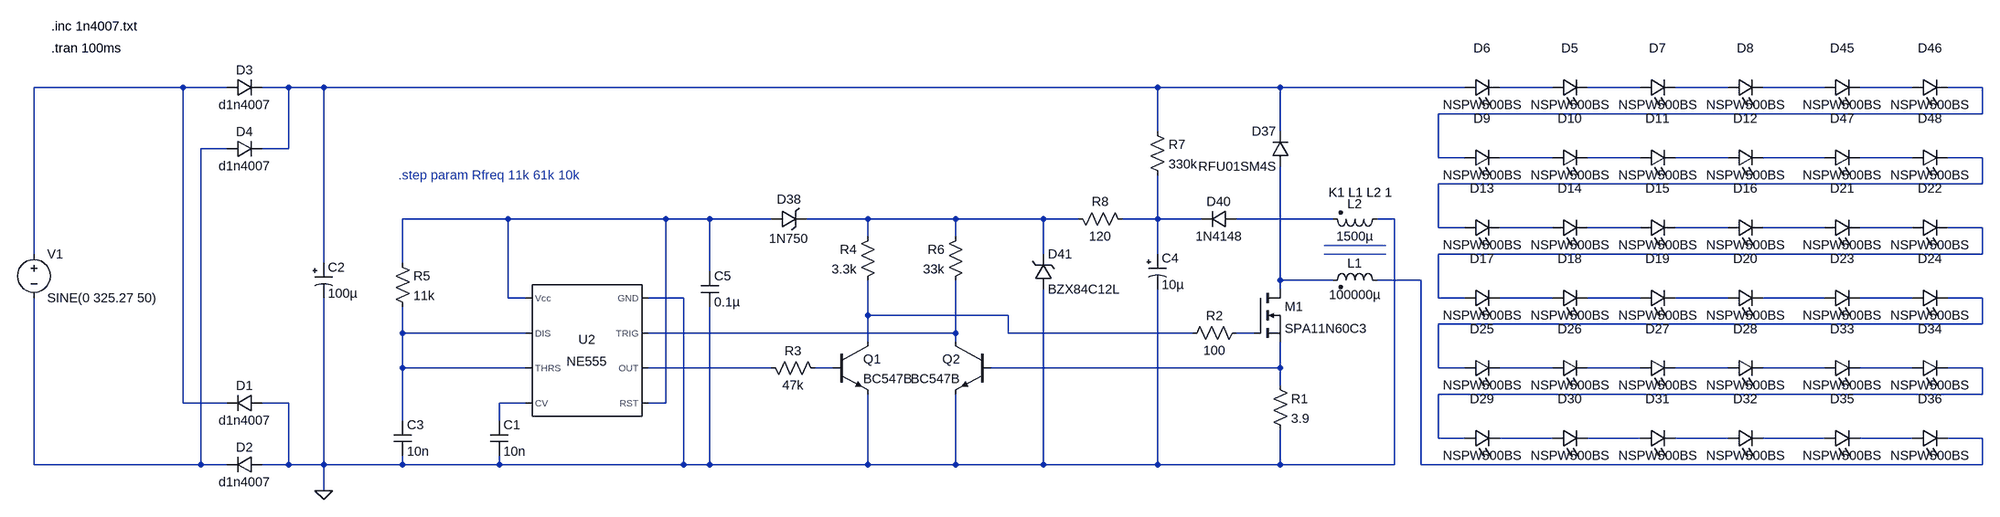
[diagram p0: schematic AC LED Driver 5.asc]
AC LED Driver 5.asc, the LTspice schematic file:
Version 4
SHEET 1 4020 1492
WIRE 736 -16 464 -16
WIRE 816 -16 736 -16
WIRE 928 -16 880 -16
WIRE 992 -16 928 -16
WIRE 2512 -16 992 -16
WIRE 2736 -16 2512 -16
WIRE 3072 -16 2736 -16
WIRE 3232 -16 3136 -16
WIRE 3392 -16 3296 -16
WIRE 3552 -16 3456 -16
WIRE 3728 -16 3616 -16
WIRE 3888 -16 3792 -16
WIRE 4016 -16 3952 -16
WIRE 4016 32 4016 -16
WIRE 4016 32 3024 32
WIRE 2512 64 2512 -16
WIRE 2736 64 2736 -16
WIRE 816 96 768 96
WIRE 928 96 928 -16
WIRE 928 96 880 96
WIRE 3024 112 3024 32
WIRE 3072 112 3024 112
WIRE 3232 112 3136 112
WIRE 3392 112 3296 112
WIRE 3552 112 3456 112
WIRE 3728 112 3616 112
WIRE 3888 112 3792 112
WIRE 4016 112 3952 112
WIRE 4016 160 4016 112
WIRE 4016 160 3024 160
WIRE 1328 224 1136 224
WIRE 1616 224 1328 224
WIRE 1696 224 1616 224
WIRE 1808 224 1696 224
WIRE 1984 224 1872 224
WIRE 2144 224 1984 224
WIRE 2304 224 2144 224
WIRE 2368 224 2304 224
WIRE 2512 224 2512 144
WIRE 2512 224 2448 224
WIRE 2592 224 2512 224
WIRE 2832 224 2656 224
WIRE 2944 224 2912 224
WIRE 3024 240 3024 160
WIRE 3072 240 3024 240
WIRE 3232 240 3136 240
WIRE 3392 240 3296 240
WIRE 3552 240 3456 240
WIRE 3728 240 3616 240
WIRE 3888 240 3792 240
WIRE 4016 240 3952 240
WIRE 1984 256 1984 224
WIRE 2144 256 2144 224
WIRE 464 288 464 -16
WIRE 2304 288 2304 224
WIRE 2512 288 2512 224
WIRE 4016 288 4016 240
WIRE 4016 288 3024 288
WIRE 992 304 992 -16
WIRE 1136 304 1136 224
WIRE 1696 320 1696 224
WIRE 2736 336 2736 128
WIRE 2832 336 2736 336
WIRE 2992 336 2912 336
WIRE 2736 352 2736 336
WIRE 1328 368 1328 224
WIRE 1360 368 1328 368
WIRE 1648 368 1584 368
WIRE 3024 368 3024 288
WIRE 3072 368 3024 368
WIRE 3232 368 3136 368
WIRE 3392 368 3296 368
WIRE 3552 368 3456 368
WIRE 3728 368 3616 368
WIRE 3888 368 3792 368
WIRE 4016 368 3952 368
WIRE 1984 400 1984 336
WIRE 2240 400 1984 400
WIRE 4016 416 4016 368
WIRE 4016 416 3024 416
WIRE 1136 432 1136 384
WIRE 1360 432 1136 432
WIRE 2144 432 2144 336
WIRE 2144 432 1584 432
WIRE 2240 432 2240 400
WIRE 2576 432 2240 432
WIRE 2688 432 2656 432
WIRE 1984 448 1984 400
WIRE 2144 448 2144 432
WIRE 1136 496 1136 432
WIRE 1360 496 1136 496
WIRE 1808 496 1584 496
WIRE 1920 496 1888 496
WIRE 2736 496 2736 448
WIRE 2736 496 2208 496
WIRE 3024 496 3024 416
WIRE 3072 496 3024 496
WIRE 3232 496 3136 496
WIRE 3392 496 3296 496
WIRE 3552 496 3456 496
WIRE 3728 496 3616 496
WIRE 3888 496 3792 496
WIRE 4016 496 3952 496
WIRE 2736 528 2736 496
WIRE 4016 544 4016 496
WIRE 4016 544 3024 544
WIRE 736 560 736 -16
WIRE 816 560 736 560
WIRE 928 560 880 560
WIRE 1360 560 1312 560
WIRE 1616 560 1616 224
WIRE 1616 560 1584 560
WIRE 1136 592 1136 496
WIRE 1312 592 1312 560
WIRE 3024 624 3024 544
WIRE 3072 624 3024 624
WIRE 3232 624 3136 624
WIRE 3392 624 3296 624
WIRE 3552 624 3456 624
WIRE 3728 624 3616 624
WIRE 3888 624 3792 624
WIRE 4016 624 3952 624
WIRE 464 672 464 368
WIRE 768 672 768 96
WIRE 768 672 464 672
WIRE 816 672 768 672
WIRE 928 672 928 560
WIRE 928 672 880 672
WIRE 992 672 992 368
WIRE 992 672 928 672
WIRE 1136 672 1136 656
WIRE 1136 672 992 672
WIRE 1312 672 1312 656
WIRE 1312 672 1136 672
WIRE 1648 672 1648 368
WIRE 1648 672 1312 672
WIRE 1696 672 1696 384
WIRE 1696 672 1648 672
WIRE 1984 672 1984 544
WIRE 1984 672 1696 672
WIRE 2144 672 2144 544
WIRE 2144 672 1984 672
WIRE 2304 672 2304 352
WIRE 2304 672 2144 672
WIRE 2512 672 2512 352
WIRE 2512 672 2304 672
WIRE 2736 672 2736 608
WIRE 2736 672 2512 672
WIRE 2944 672 2944 224
WIRE 2944 672 2736 672
WIRE 2992 672 2992 336
WIRE 4016 672 4016 624
WIRE 4016 672 2992 672
WIRE 992 720 992 672
FLAG 992 720 0
SYMBOL voltage 464 272 R0
WINDOW 123 0 0 Left 2
WINDOW 39 0 0 Left 2
SYMATTR InstName V1
SYMATTR Value SINE(0 325.27 50)
SYMBOL diode 880 544 R90
WINDOW 0 0 32 VBottom 2
WINDOW 3 32 32 VTop 2
SYMATTR InstName D1
SYMATTR Value d1n4007
SYMBOL diode 880 656 R90
WINDOW 0 0 32 VBottom 2
WINDOW 3 32 32 VTop 2
SYMATTR InstName D2
SYMATTR Value d1n4007
SYMBOL diode 816 0 R270
WINDOW 0 32 32 VTop 2
WINDOW 3 0 32 VBottom 2
SYMATTR InstName D3
SYMATTR Value d1n4007
SYMBOL diode 816 112 R270
WINDOW 0 32 32 VTop 2
WINDOW 3 0 32 VBottom 2
SYMATTR InstName D4
SYMATTR Value d1n4007
SYMBOL polcap 976 304 R0
SYMATTR InstName C2
SYMATTR Value 100µ
SYMBOL LED 3072 0 R270
WINDOW 0 72 32 VTop 2
WINDOW 3 0 32 VBottom 2
SYMATTR InstName D6
SYMATTR Value NSPW500BS
SYMBOL LED 3232 0 R270
WINDOW 0 72 32 VTop 2
WINDOW 3 0 32 VBottom 2
SYMATTR InstName D5
SYMATTR Value NSPW500BS
SYMBOL LED 3392 0 R270
WINDOW 0 72 32 VTop 2
WINDOW 3 0 32 VBottom 2
SYMATTR InstName D7
SYMATTR Value NSPW500BS
SYMBOL LED 3552 0 R270
WINDOW 0 72 32 VTop 2
WINDOW 3 0 32 VBottom 2
SYMATTR InstName D8
SYMATTR Value NSPW500BS
SYMBOL LED 3072 128 R270
WINDOW 0 72 32 VTop 2
WINDOW 3 0 32 VBottom 2
SYMATTR InstName D9
SYMATTR Value NSPW500BS
SYMBOL LED 3232 128 R270
WINDOW 0 72 32 VTop 2
WINDOW 3 0 32 VBottom 2
SYMATTR InstName D10
SYMATTR Value NSPW500BS
SYMBOL LED 3392 128 R270
WINDOW 0 72 32 VTop 2
WINDOW 3 0 32 VBottom 2
SYMATTR InstName D11
SYMATTR Value NSPW500BS
SYMBOL LED 3552 128 R270
WINDOW 0 72 32 VTop 2
WINDOW 3 0 32 VBottom 2
SYMATTR InstName D12
SYMATTR Value NSPW500BS
SYMBOL LED 3728 0 R270
WINDOW 0 72 32 VTop 2
WINDOW 3 0 32 VBottom 2
SYMATTR InstName D45
SYMATTR Value NSPW500BS
SYMBOL LED 3888 0 R270
WINDOW 0 72 32 VTop 2
WINDOW 3 0 32 VBottom 2
SYMATTR InstName D46
SYMATTR Value NSPW500BS
SYMBOL LED 3728 128 R270
WINDOW 0 72 32 VTop 2
WINDOW 3 0 32 VBottom 2
SYMATTR InstName D47
SYMATTR Value NSPW500BS
SYMBOL LED 3888 128 R270
WINDOW 0 72 32 VTop 2
WINDOW 3 0 32 VBottom 2
SYMATTR InstName D48
SYMATTR Value NSPW500BS
SYMBOL LED 3072 256 R270
WINDOW 0 72 32 VTop 2
WINDOW 3 0 32 VBottom 2
SYMATTR InstName D13
SYMATTR Value NSPW500BS
SYMBOL LED 3232 256 R270
WINDOW 0 72 32 VTop 2
WINDOW 3 0 32 VBottom 2
SYMATTR InstName D14
SYMATTR Value NSPW500BS
SYMBOL LED 3392 256 R270
WINDOW 0 72 32 VTop 2
WINDOW 3 0 32 VBottom 2
SYMATTR InstName D15
SYMATTR Value NSPW500BS
SYMBOL LED 3552 256 R270
WINDOW 0 72 32 VTop 2
WINDOW 3 0 32 VBottom 2
SYMATTR InstName D16
SYMATTR Value NSPW500BS
SYMBOL LED 3072 384 R270
WINDOW 0 72 32 VTop 2
WINDOW 3 0 32 VBottom 2
SYMATTR InstName D17
SYMATTR Value NSPW500BS
SYMBOL LED 3232 384 R270
WINDOW 0 72 32 VTop 2
WINDOW 3 0 32 VBottom 2
SYMATTR InstName D18
SYMATTR Value NSPW500BS
SYMBOL LED 3392 384 R270
WINDOW 0 72 32 VTop 2
WINDOW 3 0 32 VBottom 2
SYMATTR InstName D19
SYMATTR Value NSPW500BS
SYMBOL LED 3552 384 R270
WINDOW 0 72 32 VTop 2
WINDOW 3 0 32 VBottom 2
SYMATTR InstName D20
SYMATTR Value NSPW500BS
SYMBOL LED 3728 256 R270
WINDOW 0 72 32 VTop 2
WINDOW 3 0 32 VBottom 2
SYMATTR InstName D21
SYMATTR Value NSPW500BS
SYMBOL LED 3888 256 R270
WINDOW 0 72 32 VTop 2
WINDOW 3 0 32 VBottom 2
SYMATTR InstName D22
SYMATTR Value NSPW500BS
SYMBOL LED 3728 384 R270
WINDOW 0 72 32 VTop 2
WINDOW 3 0 32 VBottom 2
SYMATTR InstName D23
SYMATTR Value NSPW500BS
SYMBOL LED 3888 384 R270
WINDOW 0 72 32 VTop 2
WINDOW 3 0 32 VBottom 2
SYMATTR InstName D24
SYMATTR Value NSPW500BS
SYMBOL LED 3072 512 R270
WINDOW 0 72 32 VTop 2
WINDOW 3 0 32 VBottom 2
SYMATTR InstName D25
SYMATTR Value NSPW500BS
SYMBOL LED 3232 512 R270
WINDOW 0 72 32 VTop 2
WINDOW 3 0 32 VBottom 2
SYMATTR InstName D26
SYMATTR Value NSPW500BS
SYMBOL LED 3392 512 R270
WINDOW 0 72 32 VTop 2
WINDOW 3 0 32 VBottom 2
SYMATTR InstName D27
SYMATTR Value NSPW500BS
SYMBOL LED 3552 512 R270
WINDOW 0 72 32 VTop 2
WINDOW 3 0 32 VBottom 2
SYMATTR InstName D28
SYMATTR Value NSPW500BS
SYMBOL LED 3072 640 R270
WINDOW 0 72 32 VTop 2
WINDOW 3 0 32 VBottom 2
SYMATTR InstName D29
SYMATTR Value NSPW500BS
SYMBOL LED 3232 640 R270
WINDOW 0 72 32 VTop 2
WINDOW 3 0 32 VBottom 2
SYMATTR InstName D30
SYMATTR Value NSPW500BS
SYMBOL LED 3392 640 R270
WINDOW 0 72 32 VTop 2
WINDOW 3 0 32 VBottom 2
SYMATTR InstName D31
SYMATTR Value NSPW500BS
SYMBOL LED 3552 640 R270
WINDOW 0 72 32 VTop 2
WINDOW 3 0 32 VBottom 2
SYMATTR InstName D32
SYMATTR Value NSPW500BS
SYMBOL LED 3728 512 R270
WINDOW 0 72 32 VTop 2
WINDOW 3 0 32 VBottom 2
SYMATTR InstName D33
SYMATTR Value NSPW500BS
SYMBOL LED 3888 512 R270
WINDOW 0 72 32 VTop 2
WINDOW 3 0 32 VBottom 2
SYMATTR InstName D34
SYMATTR Value NSPW500BS
SYMBOL LED 3728 640 R270
WINDOW 0 72 32 VTop 2
WINDOW 3 0 32 VBottom 2
SYMATTR InstName D35
SYMATTR Value NSPW500BS
SYMBOL LED 3888 640 R270
WINDOW 0 72 32 VTop 2
WINDOW 3 0 32 VBottom 2
SYMATTR InstName D36
SYMATTR Value NSPW500BS
SYMBOL nmos 2688 352 R0
SYMATTR InstName M1
SYMATTR Value SPA11N60C3
SYMBOL ind2 2928 352 M270
WINDOW 0 32 56 VTop 2
WINDOW 3 5 56 VBottom 2
SYMATTR InstName L1
SYMATTR Value 100000µ
SYMATTR Type ind
SYMBOL diode 2752 128 R180
WINDOW 0 24 64 Left 2
WINDOW 3 24 0 Left 2
SYMATTR InstName D37
SYMATTR Value RFU01SM4S
SYMBOL res 2720 512 R0
SYMATTR InstName R1
SYMATTR Value 3.9
SYMBOL npn 1920 448 R0
SYMATTR InstName Q1
SYMATTR Value BC547B
SYMBOL cap 1296 592 R0
SYMATTR InstName C1
SYMATTR Value 10n
SYMBOL cap 1120 592 R0
SYMATTR InstName C3
SYMATTR Value 10n
SYMBOL res 1120 288 R0
SYMATTR InstName R5
SYMATTR Value 11k
SYMBOL npn 2208 448 M0
SYMATTR InstName Q2
SYMATTR Value BC547B
SYMBOL res 2160 240 M0
SYMATTR InstName R6
SYMATTR Value 33k
SYMBOL res 1792 480 M90
WINDOW 0 0 56 VBottom 2
WINDOW 3 32 56 VTop 2
SYMATTR InstName R3
SYMATTR Value 47k
SYMBOL res 2000 240 M0
SYMATTR InstName R4
SYMATTR Value 3.3k
SYMBOL res 2560 448 R270
WINDOW 0 32 56 VTop 2
WINDOW 3 0 56 VBottom 2
SYMATTR InstName R2
SYMATTR Value 100
SYMBOL Misc\\NE555 1472 464 M0
SYMATTR InstName U2
SYMBOL ind2 2928 208 R90
WINDOW 0 4 56 VBottom 2
WINDOW 3 32 56 VTop 2
SYMATTR InstName L2
SYMATTR Value 1500µ
SYMATTR Type ind
SYMBOL diode 2656 208 R90
WINDOW 0 0 32 VBottom 2
WINDOW 3 32 32 VTop 2
SYMATTR InstName D40
SYMATTR Value 1N4148
SYMBOL polcap 2496 288 R0
SYMATTR InstName C4
SYMATTR Value 10µ
SYMBOL res 2464 240 M270
WINDOW 0 32 56 VTop 2
WINDOW 3 0 56 VBottom 2
SYMATTR InstName R8
SYMATTR Value 120
SYMBOL zener 2288 352 M180
WINDOW 0 24 64 Left 2
WINDOW 3 24 0 Left 2
SYMATTR InstName D41
SYMATTR Value BZX84C12L
SYMBOL res 2496 48 R0
SYMATTR InstName R7
SYMATTR Value 330k
SYMBOL zener 1808 208 M90
WINDOW 0 -4 32 VBottom 2
WINDOW 3 36 32 VTop 2
SYMATTR InstName D38
SYMATTR Value 1N750
SYMBOL cap 1680 320 R0
SYMATTR InstName C5
SYMATTR Value 0.1µ
TEXT 496 -88 Left 2 !.tran 100ms
TEXT 496 -128 Left 2 !.inc 1n4007.txt
TEXT 2824 176 Left 2 !K1 L1 L2 1
TEXT 1128 144 Left 2 ;.step param Rfreq 11k 61k 10k
LINE Normal 2928 272 2816 272
LINE Normal 2928 288 2816 288

The netlist it stands for:
* AC LED Driver 5.asc
V1 N001 N009 SINE(0 325.27 50)
D1 0 N001 d1n4007
D2 0 N009 d1n4007
D3 N001 N002 d1n4007
D4 N009 N002 d1n4007
C2 N002 0 100µ
D6 N002 N003 NSPW500BS
D5 N003 N004 NSPW500BS
D7 N004 N005 NSPW500BS
D8 N005 N006 NSPW500BS
D9 N008 N010 NSPW500BS
D10 N010 N011 NSPW500BS
D11 N011 N012 NSPW500BS
D12 N012 N013 NSPW500BS
D45 N006 N007 NSPW500BS
D46 N007 N008 NSPW500BS
D47 N013 N014 NSPW500BS
D48 N014 N015 NSPW500BS
D13 N015 N020 NSPW500BS
D14 N020 N021 NSPW500BS
D15 N021 N022 NSPW500BS
D16 N022 N023 NSPW500BS
D17 N025 N028 NSPW500BS
D18 N028 N029 NSPW500BS
D19 N029 N030 NSPW500BS
D20 N030 N031 NSPW500BS
D21 N023 N024 NSPW500BS
D22 N024 N025 NSPW500BS
D23 N031 N032 NSPW500BS
D24 N032 N033 NSPW500BS
D25 N033 N041 NSPW500BS
D26 N041 N042 NSPW500BS
D27 N042 N043 NSPW500BS
D28 N043 N044 NSPW500BS
D29 N046 N048 NSPW500BS
D30 N048 N049 NSPW500BS
D31 N049 N050 NSPW500BS
D32 N050 N051 NSPW500BS
D33 N044 N045 NSPW500BS
D34 N045 N046 NSPW500BS
D35 N051 N052 NSPW500BS
D36 N052 N027 NSPW500BS
M1 N026 N037 N040 N040 SPA11N60C3
L1 N027 N026 100000µ
D37 N026 N002 RFU01SM4S
R1 N040 0 3.9
Q1 N034 N039 0 0 BC547B
C1 N047 0 10n
C3 N035 0 10n
R5 N016 N035 11k
Q2 N036 N040 0 0 BC547B
R6 N017 N036 33k
R3 N038 N039 47k
R4 N017 N034 3.3k
R2 N034 N037 100
XU2 0 N036 N038 N016 N047 N035 N035 N016 NE555  ; pins GND TRIG OUT RST CV THRS DIS Vcc
L2 0 N019 1500µ
D40 N019 N018 1N4148
C4 N018 0 10µ
R8 N018 N017 120
D41 0 N017 BZX84C12L
R7 N002 N018 330k
D38 N016 N017 1N750
C5 N016 0 0.1µ
.model D D
.lib standard.dio
.model NPN NPN
.model PNP PNP
.lib standard.bjt
.model NMOS NMOS
.model PMOS PMOS
.lib standard.mos
.tran 100ms
.inc 1n4007.txt
K1 L1 L2 1
* .step param Rfreq 11k 61k 10k
.lib NE555.sub
.backanno
.end